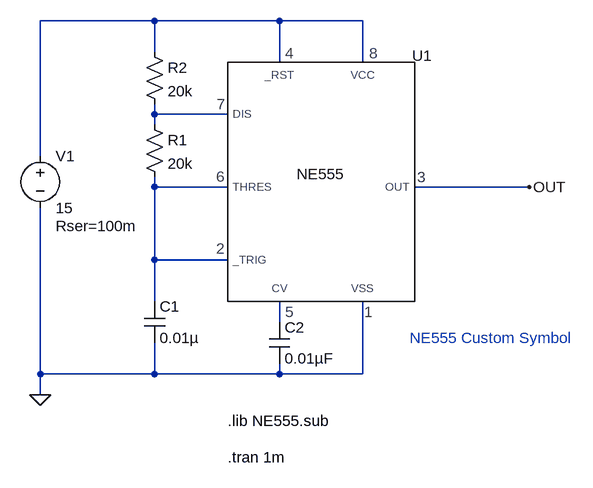
[diagram p0: schematic NE555-1_astable_Test.asc]
NE555-1_astable_Test.asc, the LTspice schematic file:
Version 4
SHEET 1 1456 948
WIRE 800 -32 624 -32
WIRE 992 -32 800 -32
WIRE 1120 -32 992 -32
WIRE 800 16 800 -32
WIRE 992 32 992 -32
WIRE 1120 32 1120 -32
WIRE 800 112 800 96
WIRE 912 112 800 112
WIRE 800 128 800 112
WIRE 624 176 624 -32
WIRE 800 224 800 208
WIRE 912 224 800 224
WIRE 1376 224 1200 224
WIRE 800 336 800 224
WIRE 912 336 800 336
WIRE 800 400 800 336
WIRE 992 432 992 400
WIRE 624 512 624 256
WIRE 800 512 800 464
WIRE 800 512 624 512
WIRE 992 512 992 496
WIRE 992 512 800 512
WIRE 1120 512 1120 400
WIRE 1120 512 992 512
WIRE 624 544 624 512
FLAG 624 544 0
FLAG 1376 224 OUT
SYMBOL voltage 624 160 R0
WINDOW 123 0 0 Left 2
WINDOW 39 24 124 Left 2
SYMATTR InstName V1
SYMATTR Value 15
SYMATTR SpiceLine Rser=100m
SYMBOL res 784 112 R0
SYMATTR InstName R1
SYMATTR Value 20k
SYMBOL res 784 0 R0
SYMATTR InstName R2
SYMATTR Value 20k
SYMBOL cap 976 432 R0
SYMATTR InstName C2
SYMATTR Value 0.01µF
SYMBOL cap 784 400 R0
SYMATTR InstName C1
SYMATTR Value 0.01µ
SYMBOL NE555-1 912 112 R0
SYMATTR InstName U1
TEXT 912 640 Left 2 !.tran 1m
TEXT 912 584 Left 2 !.lib NE555.sub
TEXT 1192 456 Left 2 ;NE555 Custom Symbol

The netlist it stands for:
* NE555-1_astable_Test.asc
V1 N001 0 15 Rser=100m
R1 N002 N003 20k
R2 N001 N002 20k
C2 N004 0 0.01µF
C1 N003 0 0.01µ
XU1 0 N003 OUT N001 N004 N003 N002 N001 NE555  ; pins VSS _TRIG OUT _RST CV THRES DIS VCC
.tran 1m
.lib NE555.sub
* NE555 Custom Symbol
.backanno
.end